# EAGLE schematic RangkaianESP32_&_RangkaianDriverMotorDC (EAGLE 9.6.2)
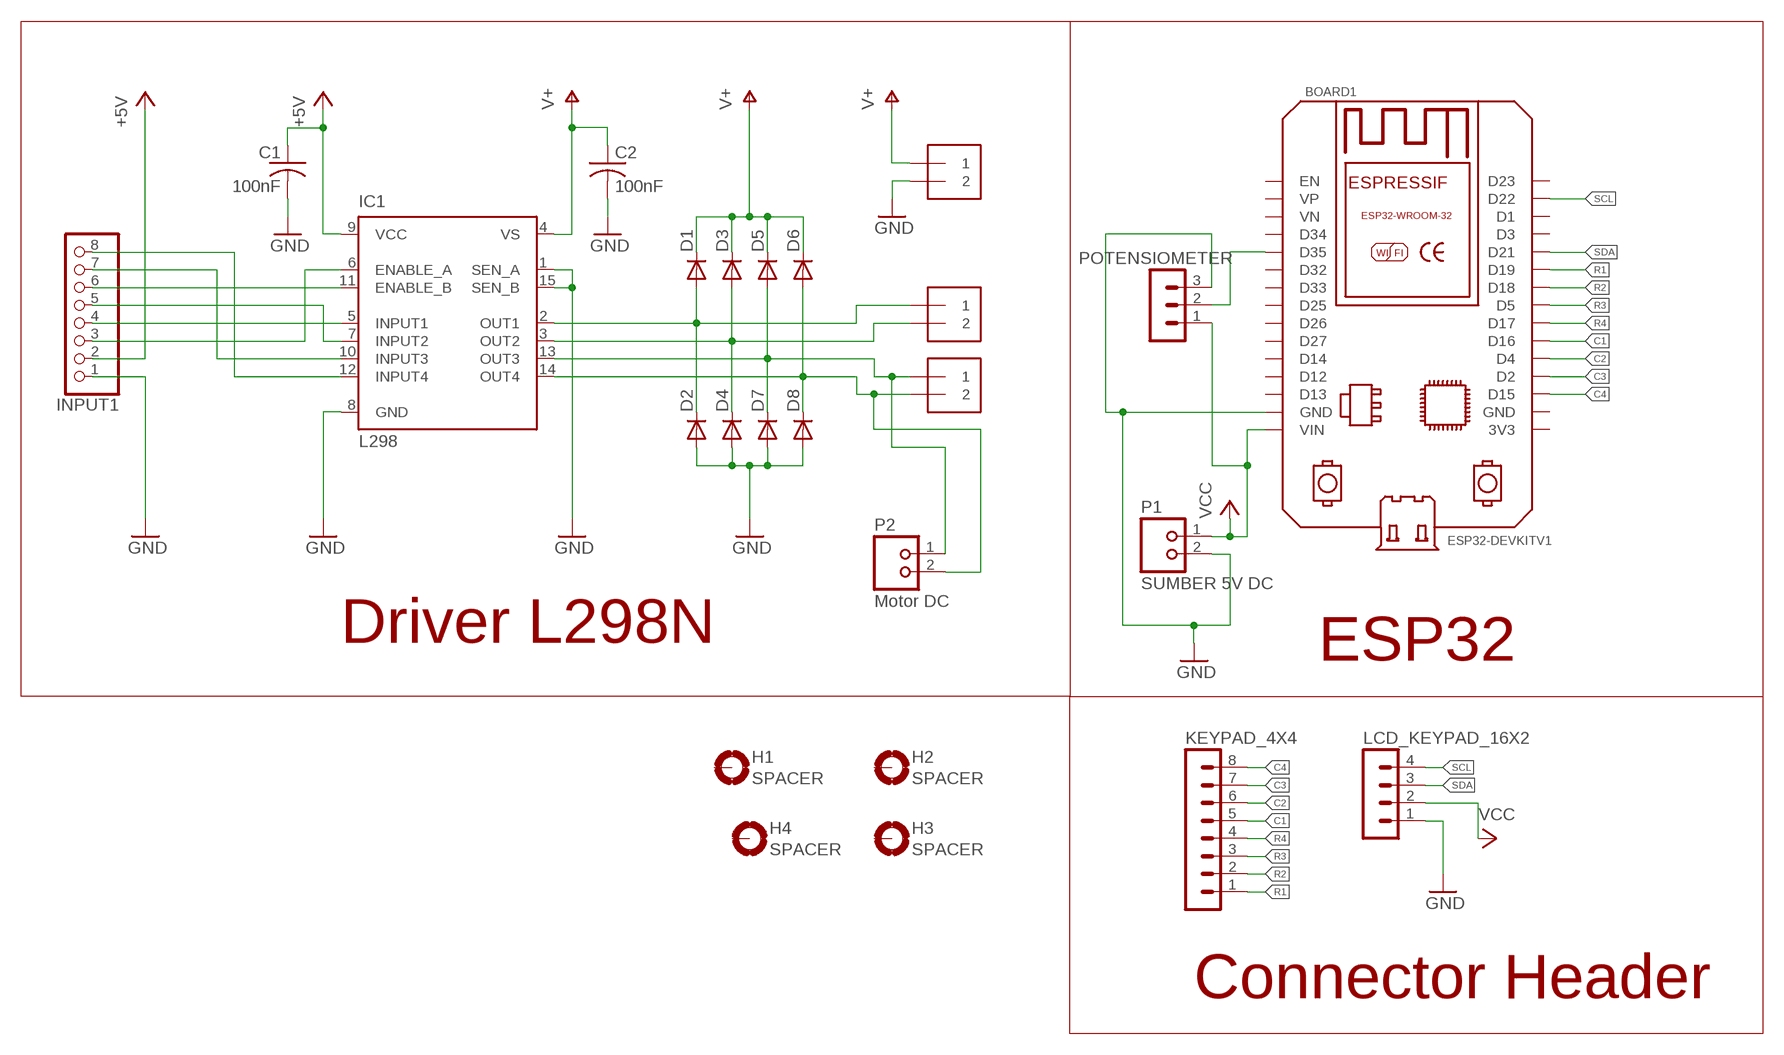
[diagram p0: schematic, sheet 1]

## Parts
BOARD1  ESP32DEVKITV1SHRIDATTDUDHAT  [ESP32-DEVKITV1]
C1  100nF  C-US050-024X044  [C050-024X044]
C2  100nF  C-US050-024X044  [C050-024X044]
D1  DIODE-D-5  [D-5]
D2  DIODE-D-5  [D-5]
D3  DIODE-D-5  [D-5]
D4  DIODE-D-5  [D-5]
D5  DIODE-D-5  [D-5]
D6  DIODE-D-5  [D-5]
D7  DIODE-D-5  [D-5]
D8  DIODE-D-5  [D-5]
H1  SPACER  [3,0-PAD]
H2  SPACER  [3,0-PAD]
H3  SPACER  [3,0-PAD]
H4  SPACER  [3,0-PAD]
IC1  L298  [MULTIWATT-15]
INPUT1  PINHD-1X8  [1X08]
KEYPAD_4X4  MA08-1  [MA08-1]
LCD_KEYPAD_16X2  MA04-1  [MA04-1]
OUTPUT1  1X2-3.5MM  [1X2-3.5MM]
OUTPUT2  1X2-3.5MM  [1X2-3.5MM]
OUTPUT3  1X2-3.5MM  [1X2-3.5MM]
P1  SUMBER 5V DC  T-BLOCK  [TERMINAL_2P]
P2  Motor DC  T-BLOCK  [TERMINAL_2P]
POTENSIOMETER  MA03-1  [MA03-1]

## Nets
+5V: C1.1 IC1.9(VCC) INPUT1.2
C1: BOARD1.D16 KEYPAD_4X4.5
C2: BOARD1.D4 KEYPAD_4X4.6
C3: BOARD1.D2 KEYPAD_4X4.7
C4: BOARD1.D15 KEYPAD_4X4.8
GND: BOARD1.GND C1.2 C2.2 D2.A D4.A D7.A D8.A IC1.1(SEN_A) IC1.8(GND) IC1.15(SEN_B) INPUT1.1 LCD_KEYPAD_16X2.1 OUTPUT1.2 P1.2 POTENSIOMETER.3
N$1: D1.A D2.C IC1.2(OUT1) OUTPUT2.1
N$2: D3.A D4.C IC1.3(OUT2) OUTPUT2.2
N$3: D6.A D8.C IC1.14(OUT4) OUTPUT3.2 P2.2
N$4: D5.A D7.C IC1.13(OUT3) OUTPUT3.1 P2.1
N$5: IC1.5(INPUT1) INPUT1.4
N$6: IC1.7(INPUT2) INPUT1.5
N$7: IC1.6(ENABLE_A) INPUT1.3
N$8: IC1.11(ENABLE_B) INPUT1.6
N$9: IC1.10(INPUT3) INPUT1.7
N$10: IC1.12(INPUT4) INPUT1.8
N$11: BOARD1.D35 POTENSIOMETER.2
R1: BOARD1.D19 KEYPAD_4X4.1
R2: BOARD1.D18 KEYPAD_4X4.2
R3: BOARD1.D5 KEYPAD_4X4.3
R4: BOARD1.D17 KEYPAD_4X4.4
SCL: BOARD1.D22 LCD_KEYPAD_16X2.4
SDA: BOARD1.D21 LCD_KEYPAD_16X2.3
V+: C2.1 D1.C D3.C D5.C D6.C IC1.4(VS) OUTPUT1.1
VCC: BOARD1.VIN LCD_KEYPAD_16X2.2 P1.1 POTENSIOMETER.1
Unconnected: BOARD1.3V3 BOARD1.D1 BOARD1.D3 BOARD1.D12 BOARD1.D13 BOARD1.D14 BOARD1.D23 BOARD1.D25 BOARD1.D26 BOARD1.D27 BOARD1.D32 BOARD1.D33 BOARD1.D34 BOARD1.EN BOARD1.GND@1(GND) BOARD1.VN BOARD1.VP H1.B3,0(MOUNT) H2.B3,0(MOUNT) H3.B3,0(MOUNT) H4.B3,0(MOUNT)

## Notes on the sheet
- Driver L298N | ESP32
- Connector Header

## Library data of the parts
BOARD1 = ESP32-DEVKITV1:ESP32DEVKITV1: https://github.com/shridattdudhat
C1 C2 = rcl:C-US: CAPACITOR, American symbol
D1-D8 = diode:DIODE-: DIODE
H1-H4 = LIBRARY LKS BARU:SPACER: MOUNTING PAD, round
IC1 = st-microelectronics:L298: DUAL FULL-BRIDGE DRIVER; MPN: L298N; OC_FARNELL: 1589425; OC_NEWARK: 32M1527
INPUT1 = pinhead:PINHD-1X8: PIN HEADER
KEYPAD_4X4 = con-lstb:MA08-1: PIN HEADER; OC_FARNELL: unknown; OC_NEWARK: unknown
LCD_KEYPAD_16X2 = con-lstb:MA04-1: PIN HEADER; OC_FARNELL: unknown; OC_NEWARK: unknown
OUTPUT1-OUTPUT3 = adafruit:1X2: 3.5mm Terminal block http://www.ladyada.net/library/pcb/eaglelibrary.html
P1 P2 = 00-lksprov2021-A1:T-BLOCK
POTENSIOMETER = con-lstb:MA03-1: PIN HEADER; OC_FARNELL: unknown; OC_NEWARK: unknown